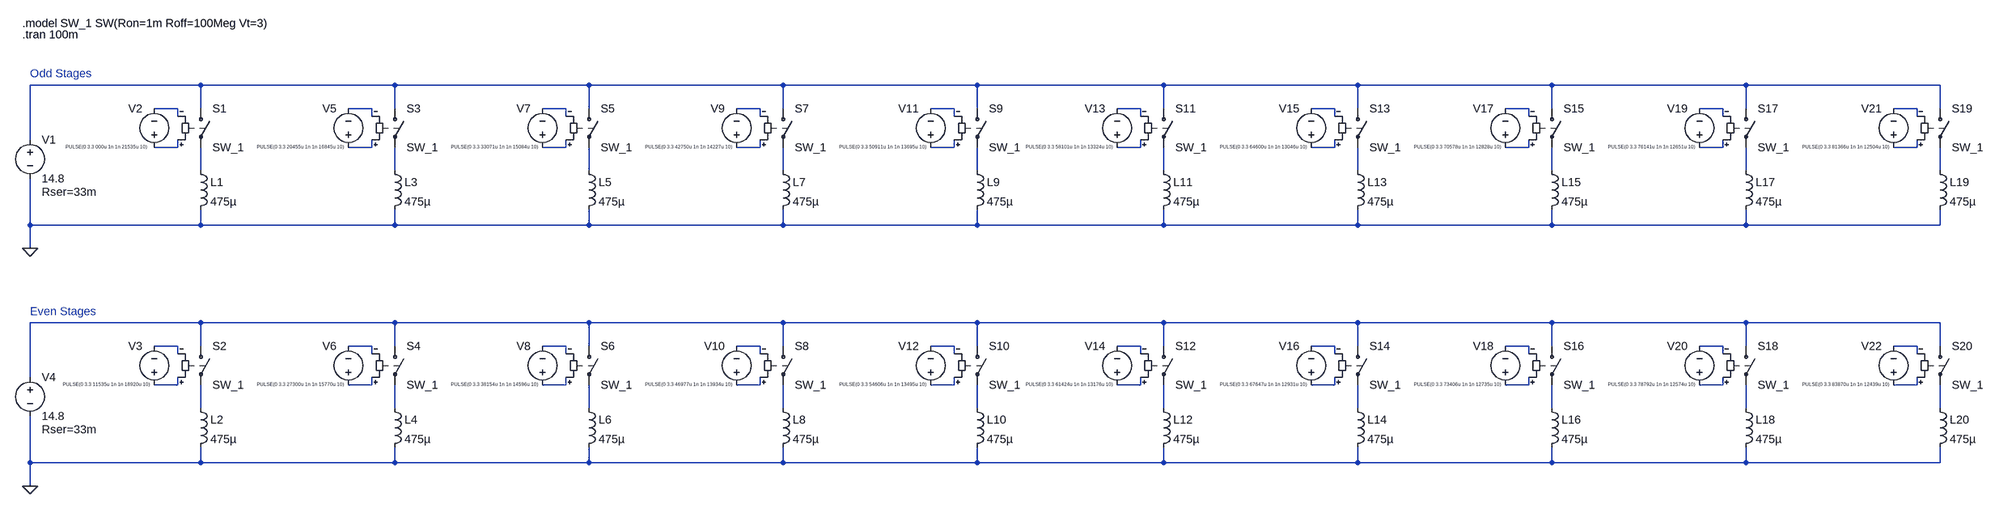
[diagram p0: schematic coilgun4.asc]
coilgun4.asc, the LTspice schematic file:
Version 4.1
SHEET 1 8016 836
WIRE 384 -16 32 -16
WIRE 784 -16 384 -16
WIRE 1184 -16 784 -16
WIRE 1584 -16 1184 -16
WIRE 1984 -16 1584 -16
WIRE 2368 -16 1984 -16
WIRE 2768 -16 2368 -16
WIRE 3168 -16 2768 -16
WIRE 3568 -16 3168 -16
WIRE 3968 -16 3568 -16
WIRE 336 32 288 32
WIRE 384 32 384 -16
WIRE 736 32 688 32
WIRE 784 32 784 -16
WIRE 1136 32 1088 32
WIRE 1184 32 1184 -16
WIRE 1536 32 1488 32
WIRE 1584 32 1584 -16
WIRE 1936 32 1888 32
WIRE 1984 32 1984 -16
WIRE 2320 32 2272 32
WIRE 2368 32 2368 -16
WIRE 2720 32 2672 32
WIRE 2768 32 2768 -16
WIRE 3120 32 3072 32
WIRE 3168 32 3168 -16
WIRE 3520 32 3472 32
WIRE 3568 32 3568 -16
WIRE 3920 32 3872 32
WIRE 3968 32 3968 -16
WIRE 336 48 336 32
WIRE 736 48 736 32
WIRE 1136 48 1136 32
WIRE 1536 48 1536 32
WIRE 1936 48 1936 32
WIRE 2320 48 2320 32
WIRE 2720 48 2720 32
WIRE 3120 48 3120 32
WIRE 3520 48 3520 32
WIRE 3920 48 3920 32
WIRE 32 96 32 -16
WIRE 336 112 336 96
WIRE 336 112 288 112
WIRE 736 112 736 96
WIRE 736 112 688 112
WIRE 1136 112 1136 96
WIRE 1136 112 1088 112
WIRE 1536 112 1536 96
WIRE 1536 112 1488 112
WIRE 1936 112 1936 96
WIRE 1936 112 1888 112
WIRE 2320 112 2320 96
WIRE 2320 112 2272 112
WIRE 2720 112 2720 96
WIRE 2720 112 2672 112
WIRE 3120 112 3120 96
WIRE 3120 112 3072 112
WIRE 3520 112 3520 96
WIRE 3520 112 3472 112
WIRE 3920 112 3920 96
WIRE 3920 112 3872 112
WIRE 384 160 384 112
WIRE 784 160 784 112
WIRE 1184 160 1184 112
WIRE 1584 160 1584 112
WIRE 1984 160 1984 112
WIRE 2368 160 2368 112
WIRE 2768 160 2768 112
WIRE 3168 160 3168 112
WIRE 3568 160 3568 112
WIRE 3968 160 3968 112
WIRE 32 272 32 176
WIRE 384 272 384 240
WIRE 384 272 32 272
WIRE 784 272 784 240
WIRE 784 272 384 272
WIRE 1184 272 1184 240
WIRE 1184 272 784 272
WIRE 1584 272 1584 240
WIRE 1584 272 1184 272
WIRE 1984 272 1984 240
WIRE 1984 272 1584 272
WIRE 2368 272 2368 240
WIRE 2368 272 1984 272
WIRE 2768 272 2768 240
WIRE 2768 272 2368 272
WIRE 3168 272 3168 240
WIRE 3168 272 2768 272
WIRE 3568 272 3568 240
WIRE 3568 272 3168 272
WIRE 3968 272 3968 240
WIRE 3968 272 3568 272
WIRE 32 320 32 272
WIRE 384 480 32 480
WIRE 784 480 384 480
WIRE 1184 480 784 480
WIRE 1584 480 1184 480
WIRE 1984 480 1584 480
WIRE 2368 480 1984 480
WIRE 2768 480 2368 480
WIRE 3168 480 2768 480
WIRE 3568 480 3168 480
WIRE 3968 480 3568 480
WIRE 336 528 288 528
WIRE 384 528 384 480
WIRE 736 528 688 528
WIRE 784 528 784 480
WIRE 1136 528 1088 528
WIRE 1184 528 1184 480
WIRE 1536 528 1488 528
WIRE 1584 528 1584 480
WIRE 1936 528 1888 528
WIRE 1984 528 1984 480
WIRE 2320 528 2272 528
WIRE 2368 528 2368 480
WIRE 2720 528 2672 528
WIRE 2768 528 2768 480
WIRE 3120 528 3072 528
WIRE 3168 528 3168 480
WIRE 3520 528 3472 528
WIRE 3568 528 3568 480
WIRE 3920 528 3872 528
WIRE 3968 528 3968 480
WIRE 336 544 336 528
WIRE 736 544 736 528
WIRE 1136 544 1136 528
WIRE 1536 544 1536 528
WIRE 1936 544 1936 528
WIRE 2320 544 2320 528
WIRE 2720 544 2720 528
WIRE 3120 544 3120 528
WIRE 3520 544 3520 528
WIRE 3920 544 3920 528
WIRE 32 592 32 480
WIRE 336 608 336 592
WIRE 336 608 288 608
WIRE 736 608 736 592
WIRE 736 608 688 608
WIRE 1136 608 1136 592
WIRE 1136 608 1088 608
WIRE 1536 608 1536 592
WIRE 1536 608 1488 608
WIRE 1936 608 1936 592
WIRE 1936 608 1888 608
WIRE 2320 608 2320 592
WIRE 2320 608 2272 608
WIRE 2720 608 2720 592
WIRE 2720 608 2672 608
WIRE 3120 608 3120 592
WIRE 3120 608 3072 608
WIRE 3520 608 3520 592
WIRE 3520 608 3472 608
WIRE 3920 608 3920 592
WIRE 3920 608 3872 608
WIRE 384 656 384 608
WIRE 784 656 784 608
WIRE 1184 656 1184 608
WIRE 1584 656 1584 608
WIRE 1984 656 1984 608
WIRE 2368 656 2368 608
WIRE 2768 656 2768 608
WIRE 3168 656 3168 608
WIRE 3568 656 3568 608
WIRE 3968 656 3968 608
WIRE 32 768 32 672
WIRE 384 768 384 736
WIRE 384 768 32 768
WIRE 784 768 784 736
WIRE 784 768 384 768
WIRE 1184 768 1184 736
WIRE 1184 768 784 768
WIRE 1584 768 1584 736
WIRE 1584 768 1184 768
WIRE 1984 768 1984 736
WIRE 1984 768 1584 768
WIRE 2368 768 2368 736
WIRE 2368 768 1984 768
WIRE 2768 768 2768 736
WIRE 2768 768 2368 768
WIRE 3168 768 3168 736
WIRE 3168 768 2768 768
WIRE 3568 768 3568 736
WIRE 3568 768 3168 768
WIRE 3968 768 3968 736
WIRE 3968 768 3568 768
WIRE 32 816 32 768
FLAG 32 320 0
FLAG 32 816 0
SYMBOL voltage 32 80 R0
WINDOW 123 0 0 Left 0
WINDOW 39 24 124 Left 2
SYMATTR SpiceLine Rser=33m
SYMATTR InstName V1
SYMATTR Value 14.8
SYMBOL ind 368 144 R0
SYMATTR InstName L1
SYMATTR Value 475µ
SYMBOL sw 384 16 R0
SYMATTR InstName S1
SYMATTR Value SW_1
SYMBOL voltage 288 128 R180
WINDOW 0 24 96 Left 2
WINDOW 3 100 10 Top 0
WINDOW 123 0 0 Left 0
WINDOW 39 0 0 Left 0
SYMATTR InstName V2
SYMATTR Value PULSE(0 3.3 000u 1n 1n 21535u 10)
SYMBOL ind 368 640 R0
SYMATTR InstName L2
SYMATTR Value 475µ
SYMBOL sw 384 512 R0
SYMATTR InstName S2
SYMATTR Value SW_1
SYMBOL voltage 288 624 R180
WINDOW 0 24 96 Left 2
WINDOW 3 100 10 Top 0
WINDOW 123 0 0 Left 0
WINDOW 39 0 0 Left 0
SYMATTR InstName V3
SYMATTR Value PULSE(0 3.3 11535u 1n 1n 18920u 10)
SYMBOL voltage 32 576 R0
WINDOW 123 0 0 Left 0
WINDOW 39 24 124 Left 2
SYMATTR SpiceLine Rser=33m
SYMATTR InstName V4
SYMATTR Value 14.8
SYMBOL ind 768 144 R0
SYMATTR InstName L3
SYMATTR Value 475µ
SYMBOL sw 784 16 R0
SYMATTR InstName S3
SYMATTR Value SW_1
SYMBOL voltage 688 128 R180
WINDOW 0 24 96 Left 2
WINDOW 3 100 10 Top 0
WINDOW 123 0 0 Left 0
WINDOW 39 0 0 Left 0
SYMATTR InstName V5
SYMATTR Value PULSE(0 3.3 20455u 1n 1n 16845u 10)
SYMBOL ind 768 640 R0
SYMATTR InstName L4
SYMATTR Value 475µ
SYMBOL sw 784 512 R0
SYMATTR InstName S4
SYMATTR Value SW_1
SYMBOL voltage 688 624 R180
WINDOW 0 24 96 Left 2
WINDOW 3 100 10 Top 0
WINDOW 123 0 0 Left 0
WINDOW 39 0 0 Left 0
SYMATTR InstName V6
SYMATTR Value PULSE(0 3.3 27300u 1n 1n 15770u 10)
SYMBOL ind 1168 144 R0
SYMATTR InstName L5
SYMATTR Value 475µ
SYMBOL sw 1184 16 R0
SYMATTR InstName S5
SYMATTR Value SW_1
SYMBOL voltage 1088 128 R180
WINDOW 0 24 96 Left 2
WINDOW 3 100 10 Top 0
WINDOW 123 0 0 Left 0
WINDOW 39 0 0 Left 0
SYMATTR InstName V7
SYMATTR Value PULSE(0 3.3 33071u 1n 1n 15084u 10)
SYMBOL ind 1168 640 R0
SYMATTR InstName L6
SYMATTR Value 475µ
SYMBOL sw 1184 512 R0
SYMATTR InstName S6
SYMATTR Value SW_1
SYMBOL voltage 1088 624 R180
WINDOW 0 24 96 Left 2
WINDOW 3 100 10 Top 0
WINDOW 123 0 0 Left 0
WINDOW 39 0 0 Left 0
SYMATTR InstName V8
SYMATTR Value PULSE(0 3.3 38154u 1n 1n 14596u 10)
SYMBOL ind 1568 144 R0
SYMATTR InstName L7
SYMATTR Value 475µ
SYMBOL sw 1584 16 R0
SYMATTR InstName S7
SYMATTR Value SW_1
SYMBOL voltage 1488 128 R180
WINDOW 0 24 96 Left 2
WINDOW 3 100 10 Top 0
WINDOW 123 0 0 Left 0
WINDOW 39 0 0 Left 0
SYMATTR InstName V9
SYMATTR Value PULSE(0 3.3 42750u 1n 1n 14227u 10)
SYMBOL ind 1568 640 R0
SYMATTR InstName L8
SYMATTR Value 475µ
SYMBOL sw 1584 512 R0
SYMATTR InstName S8
SYMATTR Value SW_1
SYMBOL voltage 1488 624 R180
WINDOW 0 24 96 Left 2
WINDOW 3 100 10 Top 0
WINDOW 123 0 0 Left 0
WINDOW 39 0 0 Left 0
SYMATTR InstName V10
SYMATTR Value PULSE(0 3.3 46977u 1n 1n 13934u 10)
SYMBOL ind 1968 144 R0
SYMATTR InstName L9
SYMATTR Value 475µ
SYMBOL sw 1984 16 R0
SYMATTR InstName S9
SYMATTR Value SW_1
SYMBOL voltage 1888 128 R180
WINDOW 0 24 96 Left 2
WINDOW 3 100 10 Top 0
WINDOW 123 0 0 Left 0
WINDOW 39 0 0 Left 0
SYMATTR InstName V11
SYMATTR Value PULSE(0 3.3 50911u 1n 1n 13695u 10)
SYMBOL ind 1968 640 R0
SYMATTR InstName L10
SYMATTR Value 475µ
SYMBOL sw 1984 512 R0
SYMATTR InstName S10
SYMATTR Value SW_1
SYMBOL voltage 1888 624 R180
WINDOW 0 24 96 Left 2
WINDOW 3 100 10 Top 0
WINDOW 123 0 0 Left 0
WINDOW 39 0 0 Left 0
SYMATTR InstName V12
SYMATTR Value PULSE(0 3.3 54606u 1n 1n 13495u 10)
SYMBOL ind 2352 144 R0
SYMATTR InstName L11
SYMATTR Value 475µ
SYMBOL sw 2368 16 R0
SYMATTR InstName S11
SYMATTR Value SW_1
SYMBOL voltage 2272 128 R180
WINDOW 0 24 96 Left 2
WINDOW 3 100 10 Top 0
WINDOW 123 0 0 Left 0
WINDOW 39 0 0 Left 0
SYMATTR InstName V13
SYMATTR Value PULSE(0 3.3 58101u 1n 1n 13324u 10)
SYMBOL ind 2352 640 R0
SYMATTR InstName L12
SYMATTR Value 475µ
SYMBOL sw 2368 512 R0
SYMATTR InstName S12
SYMATTR Value SW_1
SYMBOL voltage 2272 624 R180
WINDOW 0 24 96 Left 2
WINDOW 3 100 10 Top 0
WINDOW 123 0 0 Left 0
WINDOW 39 0 0 Left 0
SYMATTR InstName V14
SYMATTR Value PULSE(0 3.3 61424u 1n 1n 13176u 10)
SYMBOL ind 2752 144 R0
SYMATTR InstName L13
SYMATTR Value 475µ
SYMBOL sw 2768 16 R0
SYMATTR InstName S13
SYMATTR Value SW_1
SYMBOL voltage 2672 128 R180
WINDOW 0 24 96 Left 2
WINDOW 3 100 10 Top 0
WINDOW 123 0 0 Left 0
WINDOW 39 0 0 Left 0
SYMATTR InstName V15
SYMATTR Value PULSE(0 3.3 64600u 1n 1n 13046u 10)
SYMBOL ind 2752 640 R0
SYMATTR InstName L14
SYMATTR Value 475µ
SYMBOL sw 2768 512 R0
SYMATTR InstName S14
SYMATTR Value SW_1
SYMBOL voltage 2672 624 R180
WINDOW 0 24 96 Left 2
WINDOW 3 100 10 Top 0
WINDOW 123 0 0 Left 0
WINDOW 39 0 0 Left 0
SYMATTR InstName V16
SYMATTR Value PULSE(0 3.3 67647u 1n 1n 12931u 10)
SYMBOL ind 3152 144 R0
SYMATTR InstName L15
SYMATTR Value 475µ
SYMBOL sw 3168 16 R0
SYMATTR InstName S15
SYMATTR Value SW_1
SYMBOL voltage 3072 128 R180
WINDOW 0 24 96 Left 2
WINDOW 3 100 10 Top 0
WINDOW 123 0 0 Left 0
WINDOW 39 0 0 Left 0
SYMATTR InstName V17
SYMATTR Value PULSE(0 3.3 70578u 1n 1n 12828u 10)
SYMBOL ind 3152 640 R0
SYMATTR InstName L16
SYMATTR Value 475µ
SYMBOL sw 3168 512 R0
SYMATTR InstName S16
SYMATTR Value SW_1
SYMBOL voltage 3072 624 R180
WINDOW 0 24 96 Left 2
WINDOW 3 100 10 Top 0
WINDOW 123 0 0 Left 0
WINDOW 39 0 0 Left 0
SYMATTR InstName V18
SYMATTR Value PULSE(0 3.3 73406u 1n 1n 12735u 10)
SYMBOL ind 3552 144 R0
SYMATTR InstName L17
SYMATTR Value 475µ
SYMBOL sw 3568 16 R0
SYMATTR InstName S17
SYMATTR Value SW_1
SYMBOL voltage 3472 128 R180
WINDOW 0 24 96 Left 2
WINDOW 3 100 10 Top 0
WINDOW 123 0 0 Left 0
WINDOW 39 0 0 Left 0
SYMATTR InstName V19
SYMATTR Value PULSE(0 3.3 76141u 1n 1n 12651u 10)
SYMBOL ind 3552 640 R0
SYMATTR InstName L18
SYMATTR Value 475µ
SYMBOL sw 3568 512 R0
SYMATTR InstName S18
SYMATTR Value SW_1
SYMBOL voltage 3472 624 R180
WINDOW 0 24 96 Left 2
WINDOW 3 100 10 Top 0
WINDOW 123 0 0 Left 0
WINDOW 39 0 0 Left 0
SYMATTR InstName V20
SYMATTR Value PULSE(0 3.3 78792u 1n 1n 12574u 10)
SYMBOL ind 3952 144 R0
SYMATTR InstName L19
SYMATTR Value 475µ
SYMBOL sw 3968 16 R0
SYMATTR InstName S19
SYMATTR Value SW_1
SYMBOL voltage 3872 128 R180
WINDOW 0 24 96 Left 2
WINDOW 3 100 10 Top 0
WINDOW 123 0 0 Left 0
WINDOW 39 0 0 Left 0
SYMATTR InstName V21
SYMATTR Value PULSE(0 3.3 81366u 1n 1n 12504u 10)
SYMBOL ind 3952 640 R0
SYMATTR InstName L20
SYMATTR Value 475µ
SYMBOL sw 3968 512 R0
SYMATTR InstName S20
SYMATTR Value SW_1
SYMBOL voltage 3872 624 R180
WINDOW 0 24 96 Left 2
WINDOW 3 100 10 Top 0
WINDOW 123 0 0 Left 0
WINDOW 39 0 0 Left 0
SYMATTR InstName V22
SYMATTR Value PULSE(0 3.3 83870u 1n 1n 12439u 10)
TEXT 16 -120 Left 2 !.tran 100m
TEXT 16 -144 Left 2 !.model SW_1 SW(Ron=1m Roff=100Meg Vt=3)
TEXT 32 -40 Left 2 ;Odd Stages
TEXT 32 456 Left 2 ;Even Stages

The netlist it stands for:
* coilgun4.asc
V1 N001 0 14.8 Rser=33m
L1 N022 0 475µ
S1 N001 N022 N012 N002 SW_1
V2 N012 N002 PULSE(0 3.3 000u 1n 1n 21535u 10)
L2 N053 0 475µ
S2 N032 N053 N043 N033 SW_1
V3 N043 N033 PULSE(0 3.3 11535u 1n 1n 18920u 10)
V4 N032 0 14.8 Rser=33m
L3 N023 0 475µ
S3 N001 N023 N013 N003 SW_1
V5 N013 N003 PULSE(0 3.3 20455u 1n 1n 16845u 10)
L4 N054 0 475µ
S4 N032 N054 N044 N034 SW_1
V6 N044 N034 PULSE(0 3.3 27300u 1n 1n 15770u 10)
L5 N024 0 475µ
S5 N001 N024 N014 N004 SW_1
V7 N014 N004 PULSE(0 3.3 33071u 1n 1n 15084u 10)
L6 N055 0 475µ
S6 N032 N055 N045 N035 SW_1
V8 N045 N035 PULSE(0 3.3 38154u 1n 1n 14596u 10)
L7 N025 0 475µ
S7 N001 N025 N015 N005 SW_1
V9 N015 N005 PULSE(0 3.3 42750u 1n 1n 14227u 10)
L8 N056 0 475µ
S8 N032 N056 N046 N036 SW_1
V10 N046 N036 PULSE(0 3.3 46977u 1n 1n 13934u 10)
L9 N026 0 475µ
S9 N001 N026 N016 N006 SW_1
V11 N016 N006 PULSE(0 3.3 50911u 1n 1n 13695u 10)
L10 N057 0 475µ
S10 N032 N057 N047 N037 SW_1
V12 N047 N037 PULSE(0 3.3 54606u 1n 1n 13495u 10)
L11 N027 0 475µ
S11 N001 N027 N017 N007 SW_1
V13 N017 N007 PULSE(0 3.3 58101u 1n 1n 13324u 10)
L12 N058 0 475µ
S12 N032 N058 N048 N038 SW_1
V14 N048 N038 PULSE(0 3.3 61424u 1n 1n 13176u 10)
L13 N028 0 475µ
S13 N001 N028 N018 N008 SW_1
V15 N018 N008 PULSE(0 3.3 64600u 1n 1n 13046u 10)
L14 N059 0 475µ
S14 N032 N059 N049 N039 SW_1
V16 N049 N039 PULSE(0 3.3 67647u 1n 1n 12931u 10)
L15 N029 0 475µ
S15 N001 N029 N019 N009 SW_1
V17 N019 N009 PULSE(0 3.3 70578u 1n 1n 12828u 10)
L16 N060 0 475µ
S16 N032 N060 N050 N040 SW_1
V18 N050 N040 PULSE(0 3.3 73406u 1n 1n 12735u 10)
L17 N030 0 475µ
S17 N001 N030 N020 N010 SW_1
V19 N020 N010 PULSE(0 3.3 76141u 1n 1n 12651u 10)
L18 N061 0 475µ
S18 N032 N061 N051 N041 SW_1
V20 N051 N041 PULSE(0 3.3 78792u 1n 1n 12574u 10)
L19 N031 0 475µ
S19 N001 N031 N021 N011 SW_1
V21 N021 N011 PULSE(0 3.3 81366u 1n 1n 12504u 10)
L20 N062 0 475µ
S20 N032 N062 N052 N042 SW_1
V22 N052 N042 PULSE(0 3.3 83870u 1n 1n 12439u 10)
.tran 100m
.model SW_1 SW(Ron=1m Roff=100Meg Vt=3)
* Odd Stages
* Even Stages
.backanno
.end